# EAGLE design board (EAGLE 9.6.2)
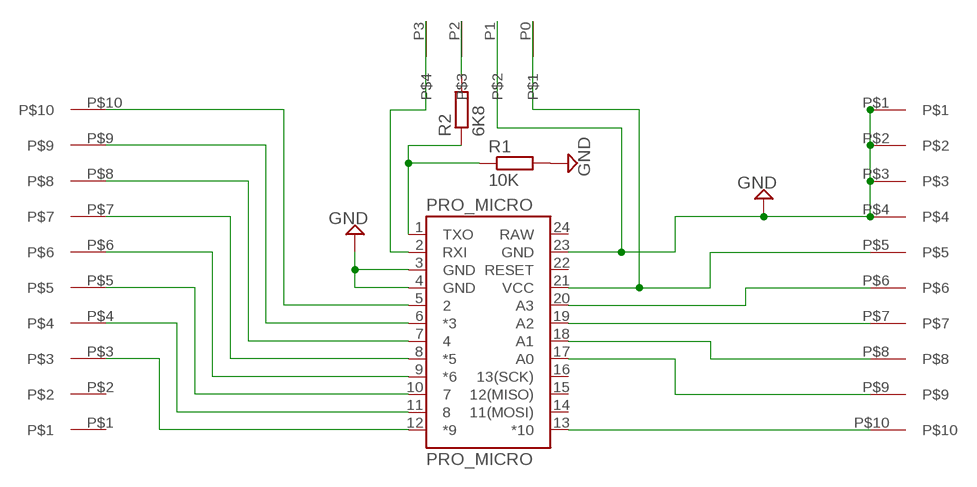
[diagram p0: schematic, sheet 1]

## Parts
PRO_MICRO  PRO_MICRO  SPARKFUN_PRO_MICRO  [SPARKFUN_PRO_MICRO]
R1  10K  R-EU_R0805  [R0805]
R2  6K8  R-EU_R0805  [R0805]
U$1  TERMINAL10  [TERMINAL10]
U$2  TERMINAL10  [TERMINAL10]
U$3  TERMINAL4  [TERMINAL4]

## Nets
GND: PRO_MICRO.3(GND) PRO_MICRO.4(GND) PRO_MICRO.23(GND) R1.2 U$2.P$1 U$2.P$2 U$2.P$3 U$2.P$4 U$3.P1
N$1: PRO_MICRO.5 U$1.P$10
N$2: PRO_MICRO.6(*3) U$1.P$9
N$3: PRO_MICRO.7 U$1.P$8
N$4: PRO_MICRO.8(*5) U$1.P$7
N$5: PRO_MICRO.9(*6) U$1.P$6
N$6: PRO_MICRO.10 U$1.P$5
N$7: PRO_MICRO.11 U$1.P$4
N$8: PRO_MICRO.12(*9) U$1.P$3
N$9: PRO_MICRO.13(*10) U$2.P$10
N$10: PRO_MICRO.17(A0) U$2.P$9
N$11: PRO_MICRO.18(A1) U$2.P$8
N$12: PRO_MICRO.19(A2) U$2.P$7
N$13: PRO_MICRO.20(A3) U$2.P$6
N$16: PRO_MICRO.1(TXO) R1.1 R2.1
N$17: PRO_MICRO.2(RXI) U$3.P3
N$18: R2.2 U$3.P2
VCC [VCC]: PRO_MICRO.21(VCC) U$2.P$5 U$3.P0
Unconnected: PRO_MICRO.14(11(MOSI)) PRO_MICRO.15(12(MISO)) PRO_MICRO.16(13(SCK)) PRO_MICRO.22(RESET) U$1.P$1 U$1.P$2

## Power pins joined to a net without a drawn wire
RAW: PRO_MICRO.24(RAW)

## Library data of the parts
PRO_MICRO = SparkFun-Boards:SPARKFUN_PRO_MICRO: SparkFun Pro Micro Atmega32U4 compatible footprint. SparkFun Products: 3.3V/8MHz <https://www.sparkfun.com/products/12587> 5V/16MHz <https://www.sparkfun.com/products/12640>
R1 R2 = rcl:R-EU_: RESISTOR, European symbol; SPICEPREFIX: R
U$1 U$2 = terminals:TERMINAL10
U$3 = terminals:TERMINAL4

## Net classes
0 default: width 1.27 mm, clearance 0.381 mm
1 VCC: width 1.778 mm, clearance 0.381 mm to class 0

## Board
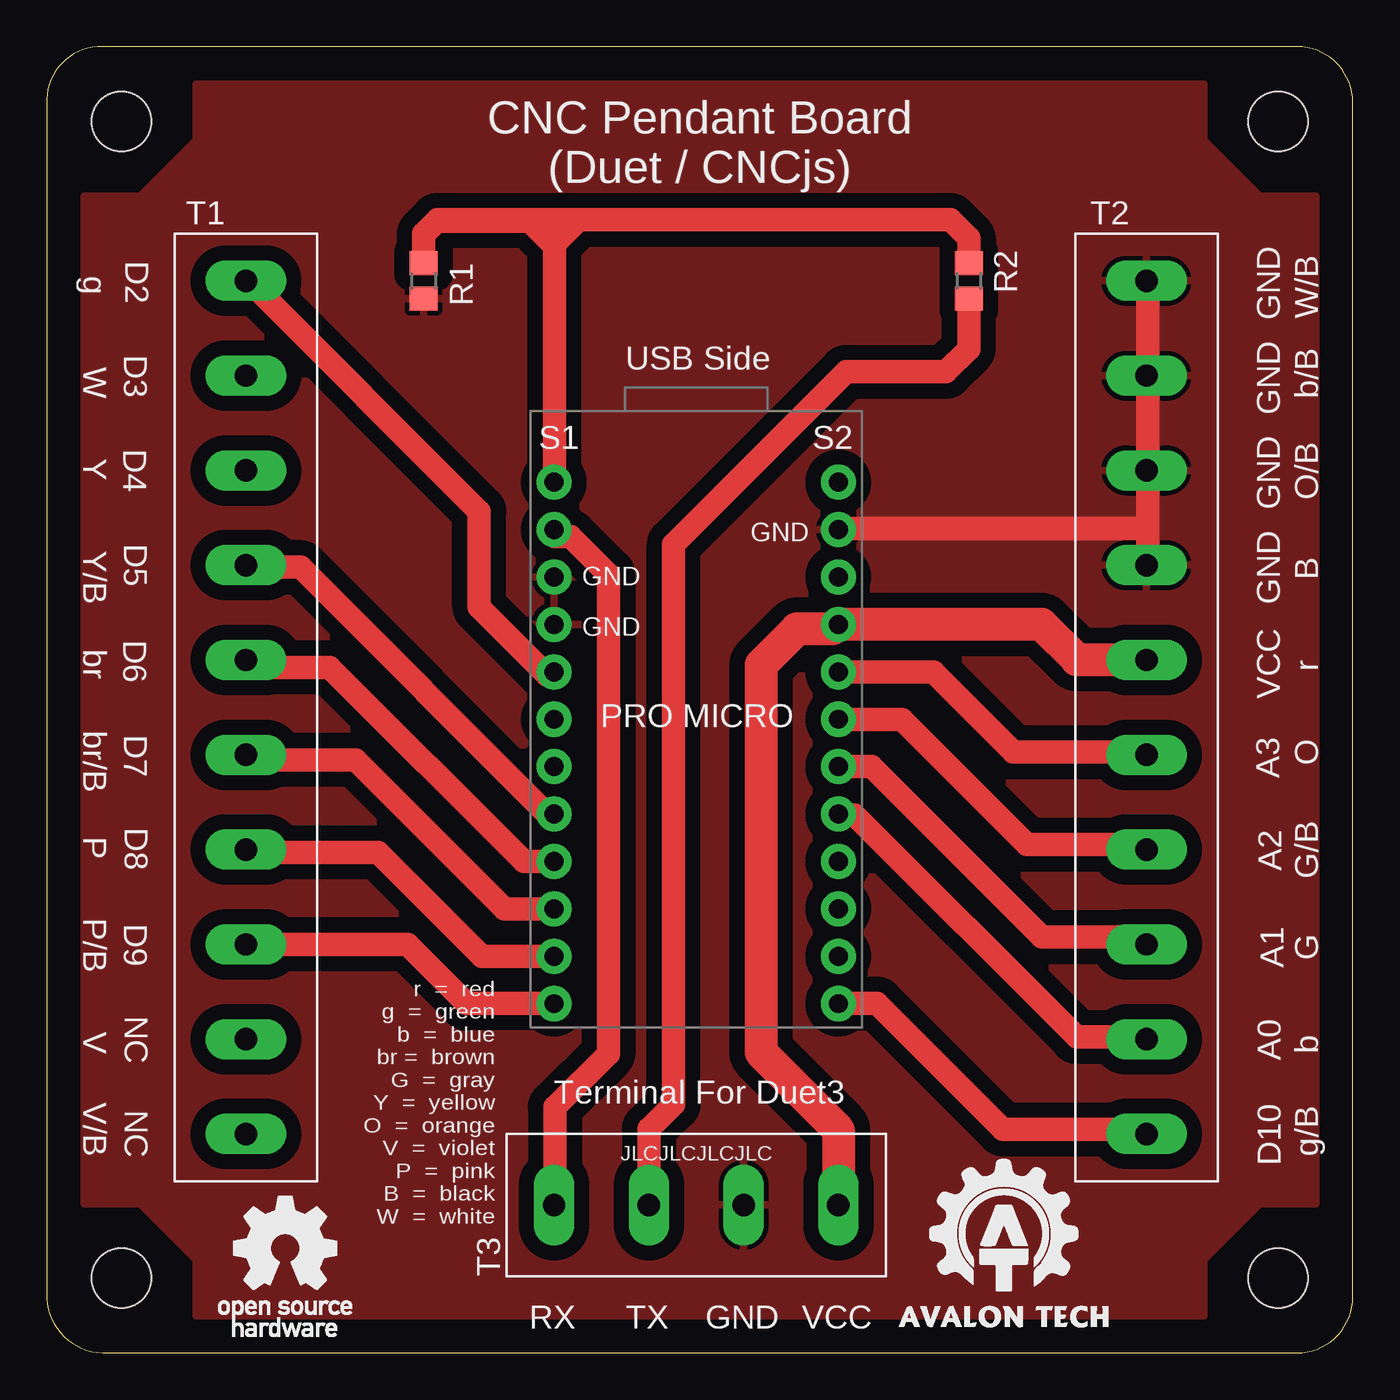
[diagram p1: board, top side]
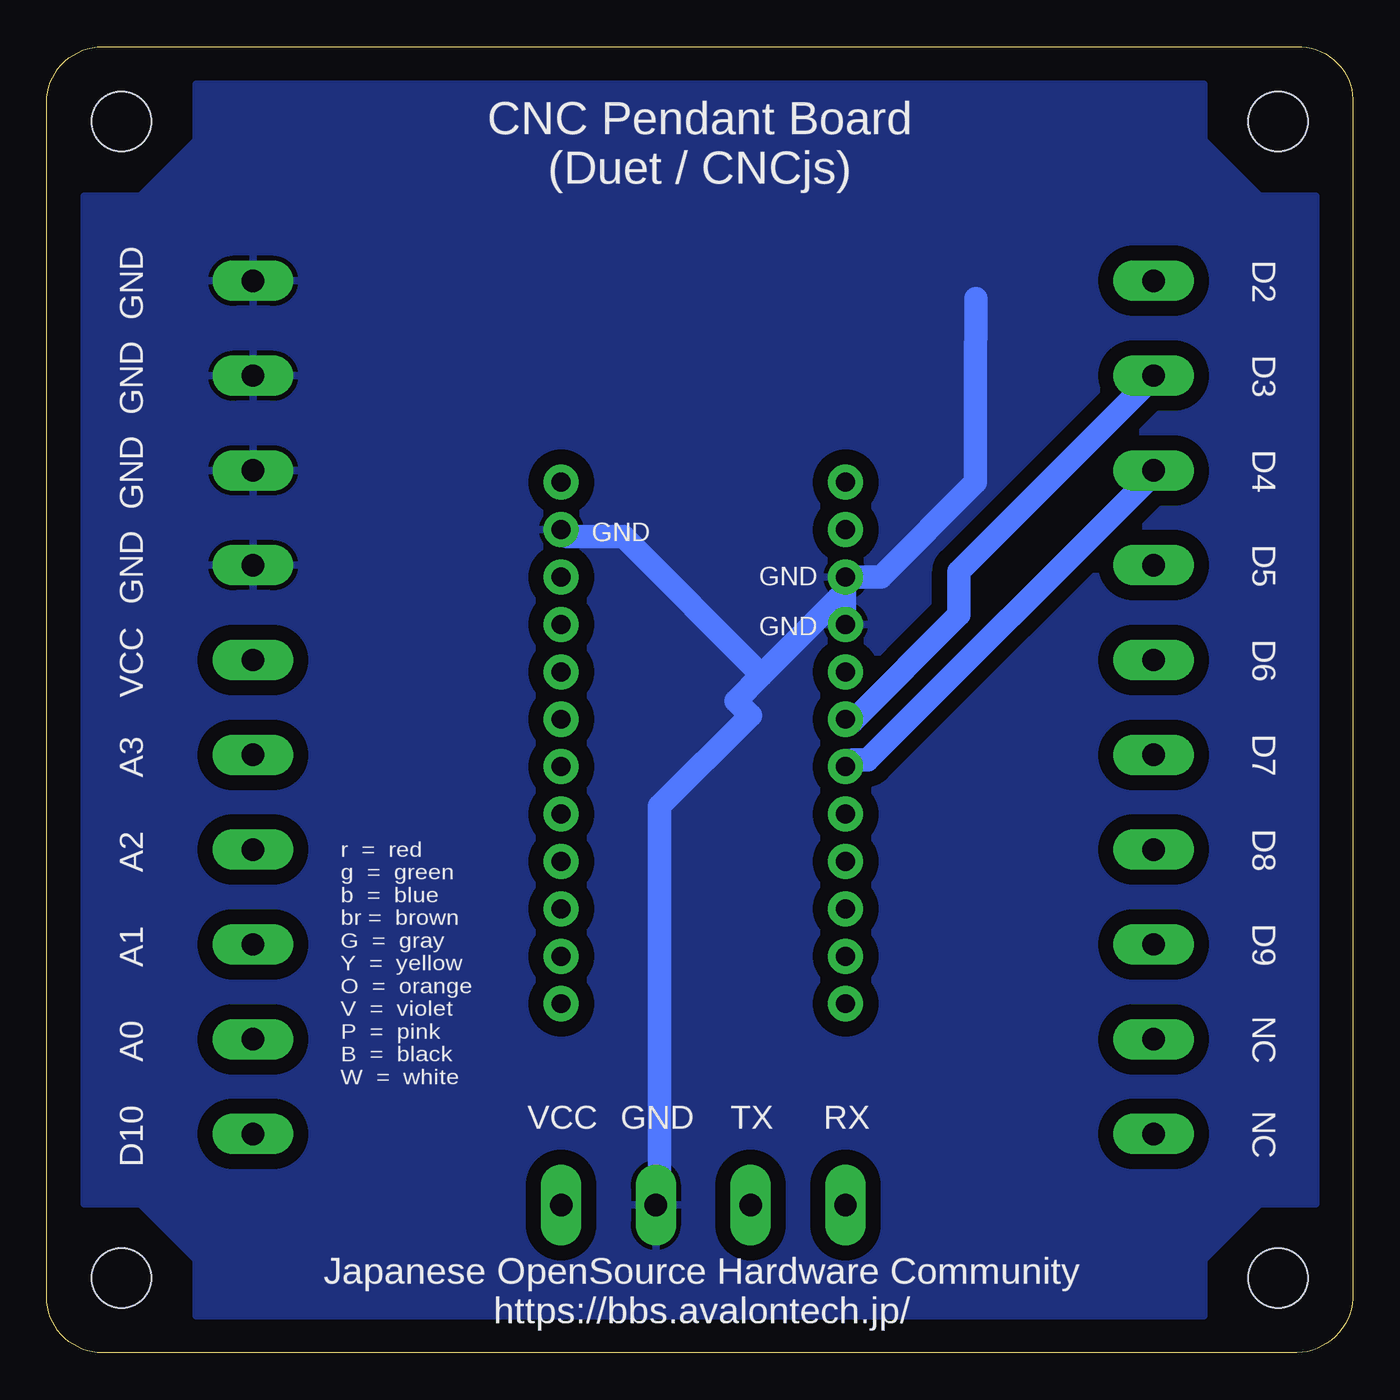
[diagram p2: board, bottom side, seen from below]

Size 70 x 70 mm. Coordinates in mm from the lower left corner, seen from the top.
Outline: 0,67.19 0,3.19 arc90 3,0 67,0 arc90 70,3 70,67 arc90 67,70 3,70 arc90 0,67.19
Copper layers (1*16): Top 0.035mm / dielectric 1.6mm / Bottom 0.035mm
Design rules "jlcpcb-2layers": minimum track width 5mil, minimum drill 0.3mm, track to track 5mil, track to pad 5mil, pad to pad 5mil, via to via 5mil, smd to smd 5mil, copper to edge 0.2mm, drill to drill 6mil, minimum pad ring 10mil, minimum via ring 3mil, stop-mask expansion 4mil, vias tented up to drill 0mil, thermal gap 10mil
Holes 3.2 mm at 4,66 66,66 4,4 66,4

### Footprints (pad centres in the part's own frame; a part is rotated, then mirrored left to right if it is on the bottom)
SPARKFUN_PRO_MICRO = drill 1.016 pad 1.88: 1 -7.62,12.7; 2 -7.62,10.16; 3 -7.62,7.62; 4 -7.62,5.08; 5 -7.62,2.54; 6 -7.62,0; 7 -7.62,-2.54; 8 -7.62,-5.08; 9 -7.62,-7.62; 10 -7.62,-10.16; 11 -7.62,-12.7; 12 -7.62,-15.24; 13 7.62,-15.24; 14 7.62,-12.7; 15 7.62,-10.16; 16 7.62,-7.62; 17 7.62,-5.08; 18 7.62,-2.54; 19 7.62,0; 20 7.62,2.54; 21 7.62,5.08; 22 7.62,7.62; 23 7.62,10.16; 24 7.62,12.7
R0805 = smd 1.3 x 1.5: 1 -0.95,0; 2 0.95,0
TERMINAL10 = drill 1.2 long: P$1 -22.86,0; P$2 -17.78,0; P$3 -12.7,0; P$4 -7.62,0; P$5 -2.54,0; P$6 2.54,0; P$7 7.62,0; P$8 12.7,0; P$9 17.78,0; P$10 22.86,0
TERMINAL4 = drill 1.2 long: P0 -7.62,0; P1 -2.54,0; P2 2.54,0; P3 7.62,0

### Placement (x,y rotation side)
PRO_MICRO  34.81,33.95 0 top
R1  20.2,57.45 270 top
R2  49.41,57.45 270 top
U$1  10.68,34.59 90 top
U$2  58.94,34.59 270 top
U$3  34.81,7.92 180 top

### Tracks (layer width: path | path; a pad name or v marks a point on that pad's centre or on a via)
GND
  Top 1.27: 59.02,44.16 59.02,47.05 U$2.P$3 59.02,47.88 59.02,52.01 U$2.P$2 59.02,52.83 59.02,57.37 U$2.P$1 | 59.02,44.16 59.02,42.51 U$2.P$4 | 59.02,44.16 42.51,44.16 PRO_MICRO.23
  Bottom 1.27: R1.2 20.23,52.01 20.23,46.65 25.3,41.58 PRO_MICRO.3 27.24,41.27 27.24,39.62 PRO_MICRO.4 27.59,40.42 31.68,36.34 | 31.68,36.34 33.07,34.94 32.29,34.16 37.15,29.3 37.15,8.26 U$3.P1 | 31.68,36.34 39.1,43.75 42.1,43.75 PRO_MICRO.23
  pour Top (isolate 0.813): 2,62 5,62 8,65 8,68 62,68 62,65 65,62 68,62 68,8 65,8 62,5 62,2 8,2 8,5 5,8 2,8
  pour Bottom (isolate 0.813): 2,62 5,62 8,65 8,68 62,68 62,65 65,62 68,62 68,8 65,8 62,5 62,2 8,2 8,5 5,8 2,8
N$1
  Top 1.27: U$1.P$10 10.82,57.45 23.18,45.1 23.18,39.97 26.83,36.32 PRO_MICRO.5
N$2
  Bottom 1.27: U$1.P$9 10.69,52.29 21.1,41.88 21.1,39.57 26.83,33.85 PRO_MICRO.6
N$3
  Bottom 1.27: U$1.P$8 10.73,47.05 26,31.78 26.83,31.78 PRO_MICRO.7
N$4
  Top 1.27: U$1.P$7 10.73,42.1 13.62,42.1 26.83,28.89 PRO_MICRO.8
N$5
  Top 1.27: U$1.P$6 10.73,36.73 15.18,36.73 25.58,26.34 PRO_MICRO.9
N$6
  Top 1.27: PRO_MICRO.10 24.54,23.8 16.55,31.78 10.73,31.78 U$1.P$5
N$7
  Top 1.27: PRO_MICRO.11 23.35,21.25 17.77,26.83 10.73,26.83 U$1.P$4
N$8
  Top 1.27: PRO_MICRO.12 22.5,18.71 19.34,21.88 10.73,21.88 U$1.P$3
N$9
  Top 1.27: PRO_MICRO.13 44.51,18.71 51.25,11.97 58.61,11.97 U$2.P$10
N$10
  Top 1.27: U$2.P$9 58.61,16.92 55.2,16.92 43.3,28.82 42.43,28.82 PRO_MICRO.17
N$11
  Top 1.27: PRO_MICRO.18 44.21,31.41 53.34,22.29 58.61,22.29 U$2.P$8
N$12
  Top 1.27: PRO_MICRO.19 45.83,33.95 52.54,27.24 58.61,27.24 U$2.P$7
N$13
  Top 1.27: U$2.P$6 58.61,32.19 51.82,32.19 47.52,36.49 PRO_MICRO.20
N$16
  Top 1.27: 27.23,59.3 27.23,46.69 PRO_MICRO.1 | 27.23,59.3 25.89,60.65 20.93,60.65 20.2,59.92 R1.1 20.2,59.97 20.95,60.72 28.54,60.72 | 28.54,60.72 48.43,60.72 49.41,59.73 R2.1 | 27.23,59.3 27.23,59.41 28.54,60.72
N$17
  Top 1.27: U$3.P3 27.24,8.26 27.24,13.17 30.11,16.03 30.11,41.71 28.07,43.75 27.24,43.75 PRO_MICRO.2
N$18
  Top 1.27: R2.2 49.41,53.8 48.2,52.58 42.85,52.58 33.6,43.32 33.6,13.32 32.27,12 U$3.P2
VCC
  Top 1.778: U$3.P0 42.43,11.94 38.28,16.11 38.28,36.87 40.21,38.8 42.1,38.8 PRO_MICRO.21 53.31,39.03 55.2,37.15 58.61,37.15 U$2.P$5

### Text on the board
tPlace: CNC Pendant Board / (Duet / CNCjs) | T1 | T2 | g | D2 | GND | W/B | USB Side | W | D3 | GND | b/B | S1 | S2 | Y | D4 | GND | O/B | GND | Y/B | D5 | GND | GND | B | GND | br | D6 | VCC | r | PRO MICRO | br/B | D7 | A3 | O | P | D8 | A2 | G/B | P/B | D9 | A1 | G | V | NC | A0 | b | Terminal For Duet3 | r = red / g = green / b = blue / br = brown / G = gray / Y = yellow / O = orange / V = violet / P = pink / B = black / W = white | V/B | NC | D10 | g/B | JLCJLCJLCJLC | T3 | RX | TX | GND | VCC
bPlace: CNC Pendant Board / (Duet / CNCjs) | D2 | GND | D3 | GND | D4 | GND | GND | D5 | GND | GND | GND | D6 | VCC | D7 | A3 | D8 | A2 | D9 | A1 | r = red / g = green / b = blue / br = brown / G = gray / Y = yellow / O = orange / V = violet / P = pink / B = black / W = white | NC | A0 | RX | TX | GND | VCC | NC | D10 | Japanese OpenSource Hardware Community / https://bbs.avalontech.jp/